# Altium project simulation.PrjPCB
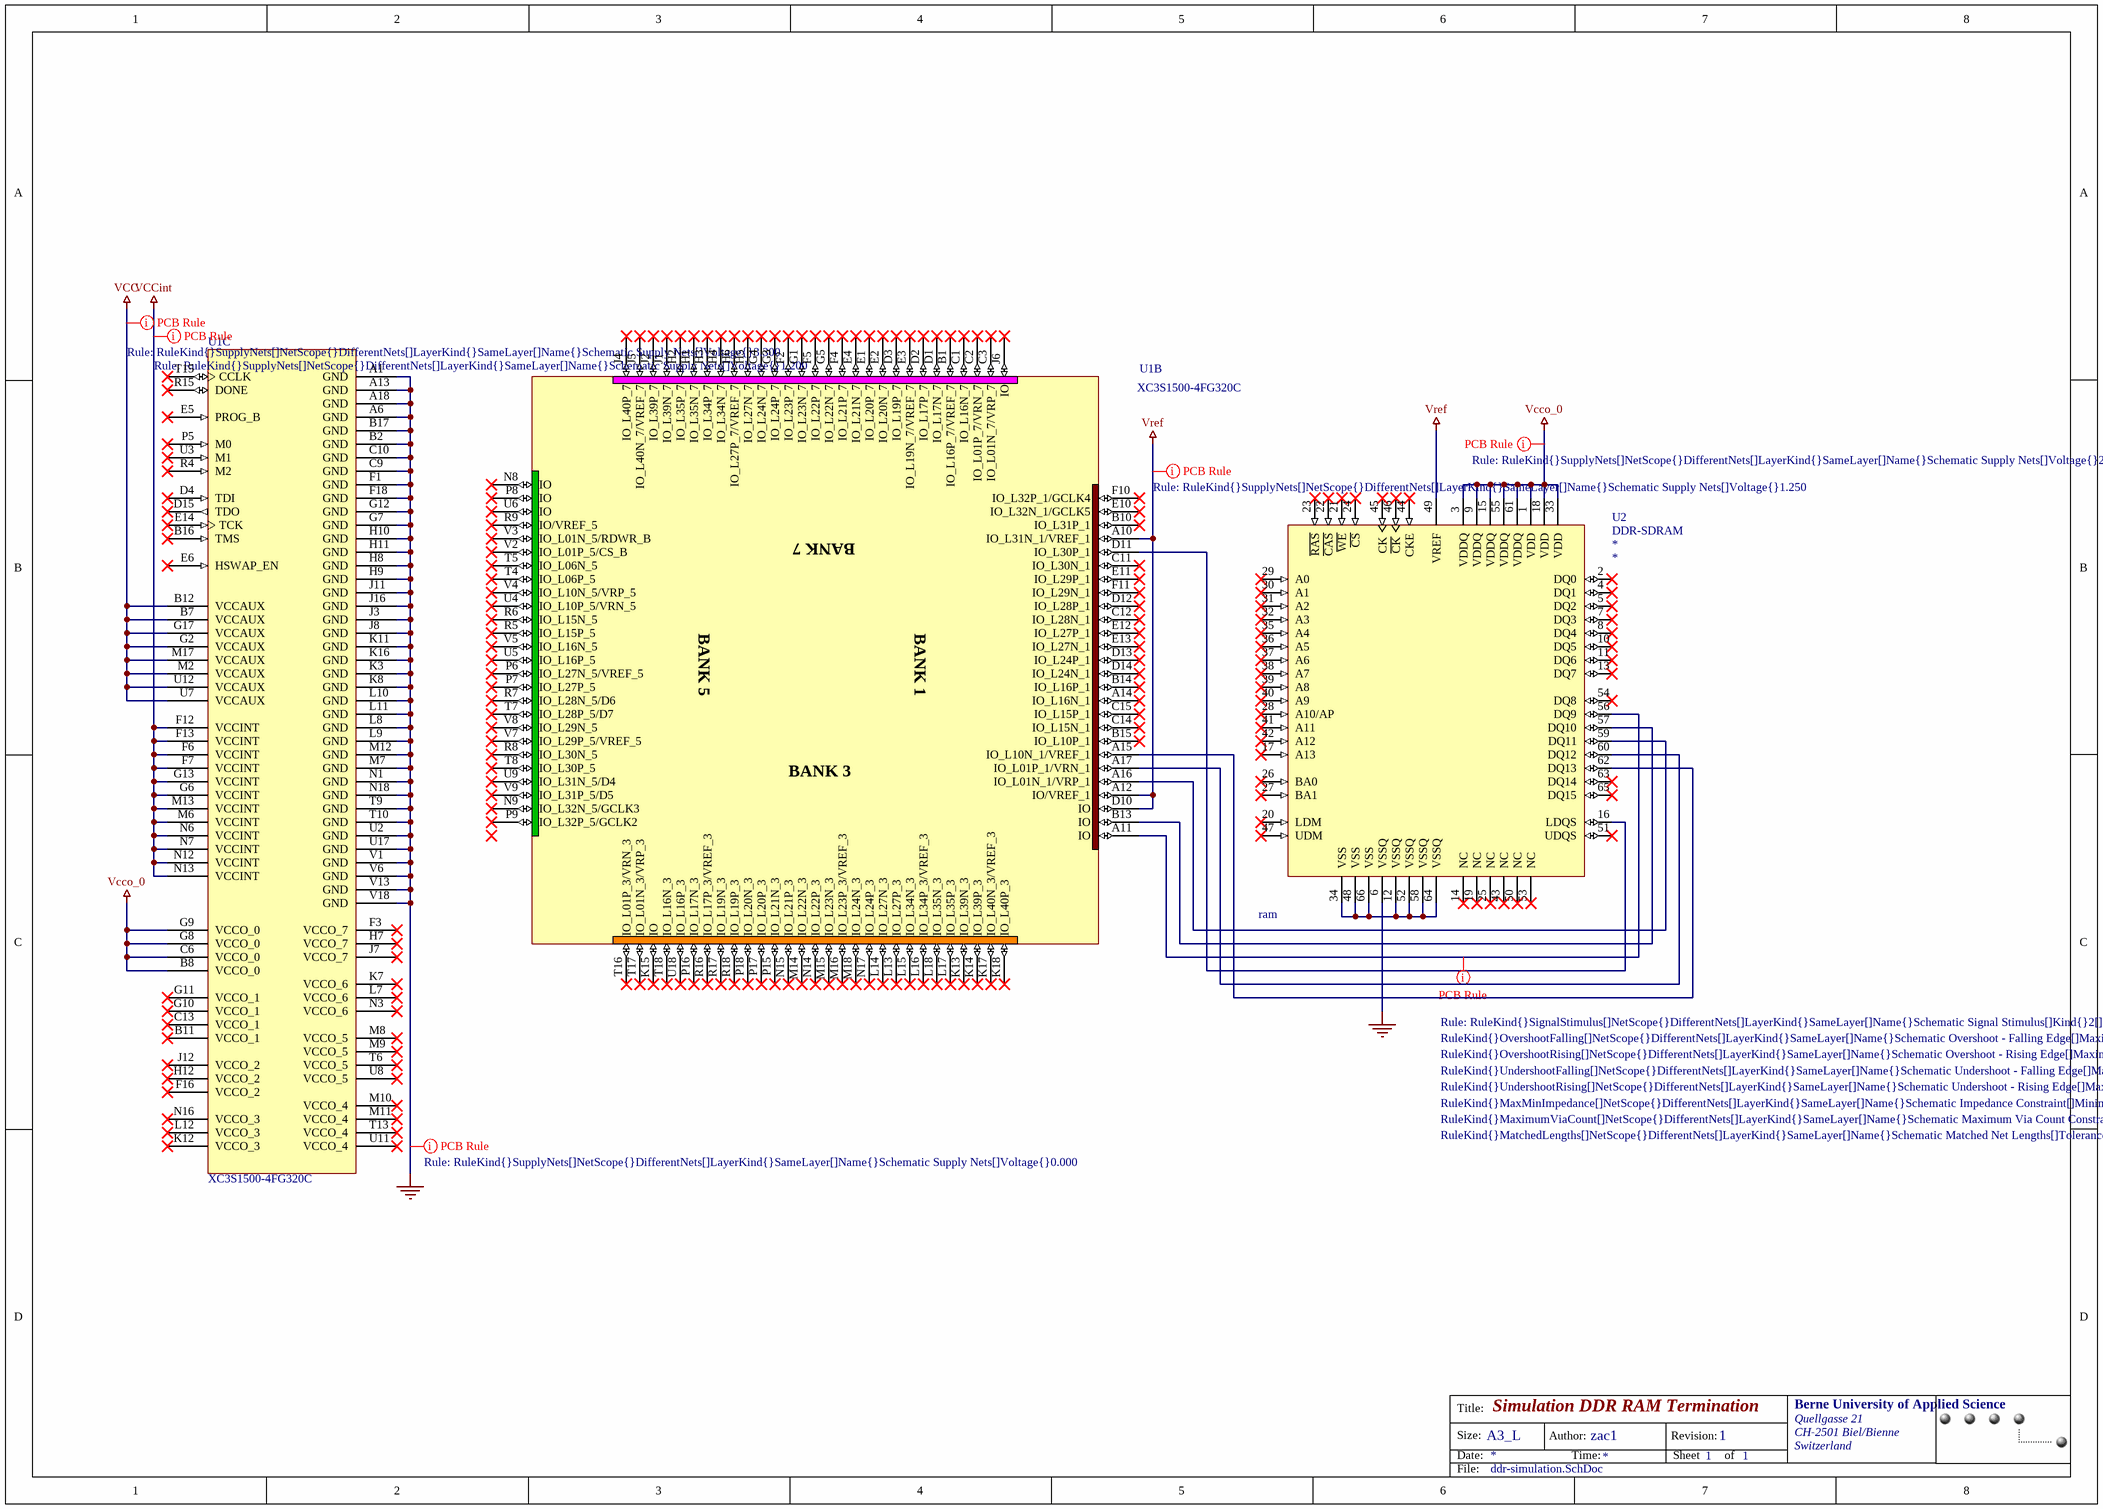
[diagram p0: ddr-simulation.SchDoc]
2 sheets, 76 parts. Net scope: global (net labels, ports and power ports of the same name join across sheets).
Sheets:
  ddr-simulation.SchDoc
  pds.SchDoc

## Sheet ddr-simulation.SchDoc: Simulation DDR RAM Termination
size A3; Organization: Berne University of Applied Science; Address1: Quellgasse 21; Address2: CH-2501 Biel/Bienne; Address3: Switzerland; Revision: 1; SheetNumber: 1; SheetTotal: 1; Author: zac1; DrawnBy: zac1

### Parts
(Parts that share a designator on the sheet are numbered #1, #2 ... from top to bottom, then left to right.)
?#1  CC License  [CC-License]  (value not drawn)
U1  XC3S1500-4FG320C  [FG320]  (parts B,C of 3)
U2  DDR-SDRAM  value ram  [TSOP66]

### Nets
GND: U1.A1(GND) U1.A6(GND) U1.A13(GND) U1.A18(GND) U1.B2(GND) U1.B17(GND) U1.C9(GND) U1.C10(GND) U1.F1(GND) U1.F18(GND) U1.G7(GND) U1.G12(GND) U1.H8(GND) U1.H9(GND) U1.H10(GND) U1.H11(GND) U1.J3(GND) U1.J8(GND) U1.J11(GND) U1.J16(GND) U1.K3(GND) U1.K8(GND) U1.K11(GND) U1.K16(GND) U1.L8(GND) U1.L9(GND) U1.L10(GND) U1.L11(GND) U1.M7(GND) U1.M12(GND) U1.N1(GND) U1.N18(GND) U1.T9(GND) U1.T10(GND) U1.U2(GND) U1.U17(GND) U1.V1(GND) U1.V6(GND) U1.V13(GND) U1.V18(GND) U2.6(VSSQ)
VCC: U1.B7(VCCAUX) U1.B12(VCCAUX) U1.G2(VCCAUX) U1.G17(VCCAUX) U1.M2(VCCAUX) U1.M17(VCCAUX) U1.U7(VCCAUX) U1.U12(VCCAUX)
VCCint: U1.F6(VCCINT) U1.F7(VCCINT) U1.F12(VCCINT) U1.F13(VCCINT) U1.G6(VCCINT) U1.G13(VCCINT) U1.M6(VCCINT) U1.M13(VCCINT) U1.N6(VCCINT) U1.N7(VCCINT) U1.N12(VCCINT) U1.N13(VCCINT)
Vcco_0: U1.B8(VCCO_0) U1.C6(VCCO_0) U1.G8(VCCO_0) U1.G9(VCCO_0) U2.1(VDD) U2.3(VDDQ) U2.9(VDDQ) U2.15(VDDQ) U2.18(VDD) U2.33(VDD) U2.55(VDDQ) U2.61(VDDQ)
Vref: U1.A10(IO_L31N_1/VREF_1) U1.A12(IO/VREF_1) U1.D10(IO) U2.49(VREF)
NetU1_A11: U1.A11(IO) U2.56(DQ9)
NetU1_A15: U1.A15(IO_L10N_1/VREF_1) U2.62(DQ13)
NetU1_A16: U1.A16(IO_L01N_1/VRP_1) U2.59(DQ11)
NetU1_A17: U1.A17(IO_L01P_1/VRN_1) U2.60(DQ12)
NetU1_B13: U1.B13(IO) U2.57(DQ10)
NetU1_D11: U1.D11(IO_L30P_1) U2.16(LDQS)
NetU2_12: U2.12(VSSQ) U2.34(VSS) U2.48(VSS) U2.52(VSSQ) U2.58(VSSQ) U2.64(VSSQ) U2.66(VSS)

Not connected (* = marked no-connect by the designer): U1 A14(IO_L16N_1)* B1(IO_L16P_7/VREF_7)* B10(IO_L31P_1)* B11(VCCO_1)* B14(IO_L16P_1)* B15(IO_L10P_1)* B16(TMS)* C1(IO_L16N_7)* C2(IO_L01P_7/VRN_7)* C3(IO_L01N_7/VRP_7)* C11(IO_L30N_1)* C12(IO_L28N_1)* C13(VCCO_1)* C14(IO_L15N_1)* C15(IO_L15P_1)* D1(IO_L17N_7)* D2(IO_L17P_7)* D3(IO_L19P_7)* D4(TDI)* D12(IO_L28P_1)* D13(IO_L24P_1)* D14(IO_L24N_1)* D15(TDO)* E1(IO_L20P_7)* E2(IO_L20N_7)* E3(IO_L19N_7/VREF_7)* E4(IO_L21N_7)* E5(PROG_B)* E6(HSWAP_EN)* E10(IO_L32N_1/GCLK5)* E11(IO_L29P_1)* E12(IO_L27P_1)* E13(IO_L27N_1)* E14(TCK)* F2(IO_L23P_7)* F3(VCCO_7)* F4(IO_L21P_7)* F5(IO_L22P_7)* F10(IO_L32P_1/GCLK4)* F11(IO_L29N_1)* F16(VCCO_2)* G1(IO_L23N_7)* G3(IO_L24P_7)* G4(IO_L24N_7)* G5(IO_L22N_7)* G10(VCCO_1)* G11(VCCO_1)* H1(IO_L35N_7)* H2(IO_L35P_7)* H3(IO_L34P_7)* H4(IO_L34N_7)* H5(IO_L27N_7)* H6(IO_L27P_7/VREF_7)* H7(VCCO_7)* H12(VCCO_2)* J1(IO_L39N_7)* J2(IO_L39P_7)* J4(IO_L40P_7)* J5(IO_L40N_7/VREF_7)* J6(IO)* J7(VCCO_7)* J12(VCCO_2)* K7(VCCO_6)* K12(VCCO_3)* K13(IO_L39N_3)* K14(IO_L39P_3)* K15(IO)* K17(IO_L40N_3/VREF_3)* K18(IO_L40P_3)* L7(VCCO_6)* L12(VCCO_3)* L13(IO_L27P_3)* L14(IO_L27N_3)* L15(IO_L34N_3)* L16(IO_L34P_3/VREF_3)* L17(IO_L35P_3)* L18(IO_L35N_3)* M8(VCCO_5)* M9(VCCO_5)* M10(VCCO_4)* M11(VCCO_4)* M14(IO_L22N_3)* M15(IO_L23N_3)* M16(IO_L23P_3/VREF_3)* M18(IO_L24N_3)* N3(VCCO_6)* N8(IO)* N9(IO_L32N_5/GCLK3)* N14(IO_L22P_3)* N15(IO_L21P_3)* N16(VCCO_3)* N17(IO_L24P_3)* P5(M0)* P6(IO_L27N_5/VREF_5)* P7(IO_L27P_5)* P8(IO)* P9(IO_L32P_5/GCLK2)* P15(IO_L21N_3)* P16(IO_L17N_3)* P17(IO_L20P_3)* P18(IO_L20N_3)* R4(M2)* R5(IO_L15P_5)* R6(IO_L15N_5)* R7(IO_L28N_5/D6)* R8(IO_L30N_5)* R9(IO/VREF_5)* R15(DONE)* R16(IO_L17P_3/VREF_3)* R17(IO_L19N_3)* R18(IO_L19P_3)* T4(IO_L06P_5)* T5(IO_L06N_5)* T6(VCCO_5)* T7(IO_L28P_5/D7)* T8(IO_L30P_5)* T13(VCCO_4)* T15(CCLK)* T16(IO_L01P_3/VRN_3)* T17(IO_L01N_3/VRP_3)* T18(IO_L16N_3)* U3(M1)* U4(IO_L10P_5/VRN_5)* U5(IO_L16P_5)* U6(IO)* U8(VCCO_5)* U9(IO_L31N_5/D4)* U11(VCCO_4)* U18(IO_L16P_3)* V2(IO_L01P_5/CS_B)* V3(IO_L01N_5/RDWR_B)* V4(IO_L10N_5/VRP_5)* V5(IO_L16N_5)* V7(IO_L29P_5/VREF_5)* V8(IO_L29N_5)* V9(IO_L31P_5/D5)*; U2 2(DQ0)* 4(DQ1)* 5(DQ2)* 7(DQ3)* 8(DQ4)* 10(DQ5)* 11(DQ6)* 13(DQ7)* 14(NC)* 17(A13)* 19(NC)* 20(LDM)* 21(~{WE})* 22(~{CAS})* 23(~{RAS})* 24(~{CS})* 25(NC)* 26(BA0)* 27(BA1)* 28(A10/AP)* 29(A0)* 30(A1)* 31(A2)* 32(A3)* 35(A4)* 36(A5)* 37(A6)* 38(A7)* 39(A8)* 40(A9)* 41(A11)* 42(A12)* 43(NC)* 44(CKE)* 45(CK)* 46(~{CK})* 47(UDM)* 50(NC)* 51(UDQS)* 53(NC)* 54(DQ8)* 63(DQ14)* 65(DQ15)*

### Layout directives
rule Supply Nets [Voltage =  3.300]: VCC
rule Supply Nets [Voltage =  1.200]: VCCint
rule Supply Nets [Voltage =  2.500]: Vcco_0
rule Supply Nets [Voltage =  1.250]: Vref
rule Supply Nets [Voltage =  0.000]: GND
rule Signal Stimulus [Kind - Periodic Pulse    Level - Low    Start Time =  0.000    Stop Time =  1.800n    Period Time =  3.600n]; rule Overshoot - Falling Edge [Max =  300.0m]; rule Overshoot - Rising Edge [Max =  300.0m]; rule Undershoot - Falling Edge [Max =  300.0m]; rule Undershoot - Rising Edge [Max =  300.0m]; rule Impedance Constraint [Min =  40.00    Max =  70.00    ]; rule Maximum Via Count Constraint [Max Count = 2]; rule Matched Net Lengths [Tolerance = 3.6mm    Style - 90 Degrees    Amplitude = 5.08mm    Gap = 0.508mm    ]: NetU1_A11

### Notes on the sheet
- Title:
- Size:
- Date:
- A3_L
- Author:
- Time:
- Revision:
- Sheet
- of
- File:
- (in symbol XC3S1500-4FG320C, part B) BANK 7; BANK 5; BANK 1; BANK 3

### Library data of the parts
U1 = XC3S1500-4FG320C: Spartan-3 1.2V FPGA, 221 User I/Os, 320-ball FBGA, Standard Performance, Commercial Grade; PackageDocument: ver1.2.1, Mar-2005; Published: 17-Dec-2003; LatestRevisionDate: 6-Jun-2005; LatestRevisionNote: Bubble removed from PROG_B pin.; DatasheetDocument: 04-Mar-2004; PackageReference: FG320; Publisher: Altium Limited; Code_JEDEC: MS-034-AAG-1; ComponentLink1Description: Manufacturer Link; ComponentLink1URL: http://www.xilinx.com/xlnx/xil_prodcat_landingpage.jsp?title=Spartan-3; ComponentLink2Description: Datasheet; ComponentLink2URL: http://direct.xilinx.com/bvdocs/publications/ds099.pdf; Value: XC3S1500-4FG320C
U2 = DDR-SDRAM: general model for ddr sdram's; vendor: *; type: *

## Sheet pds.SchDoc: GECKO3main PDS simulation
size A4; Organization: Berne University of Applied Science; Address1: Quellgasse 21; Address2: CH-2501 Biel/Bienne; Address3: Switzerland; Revision: 1; SheetNumber: 2; SheetTotal: 2; Author: zac1; DrawnBy: zac1
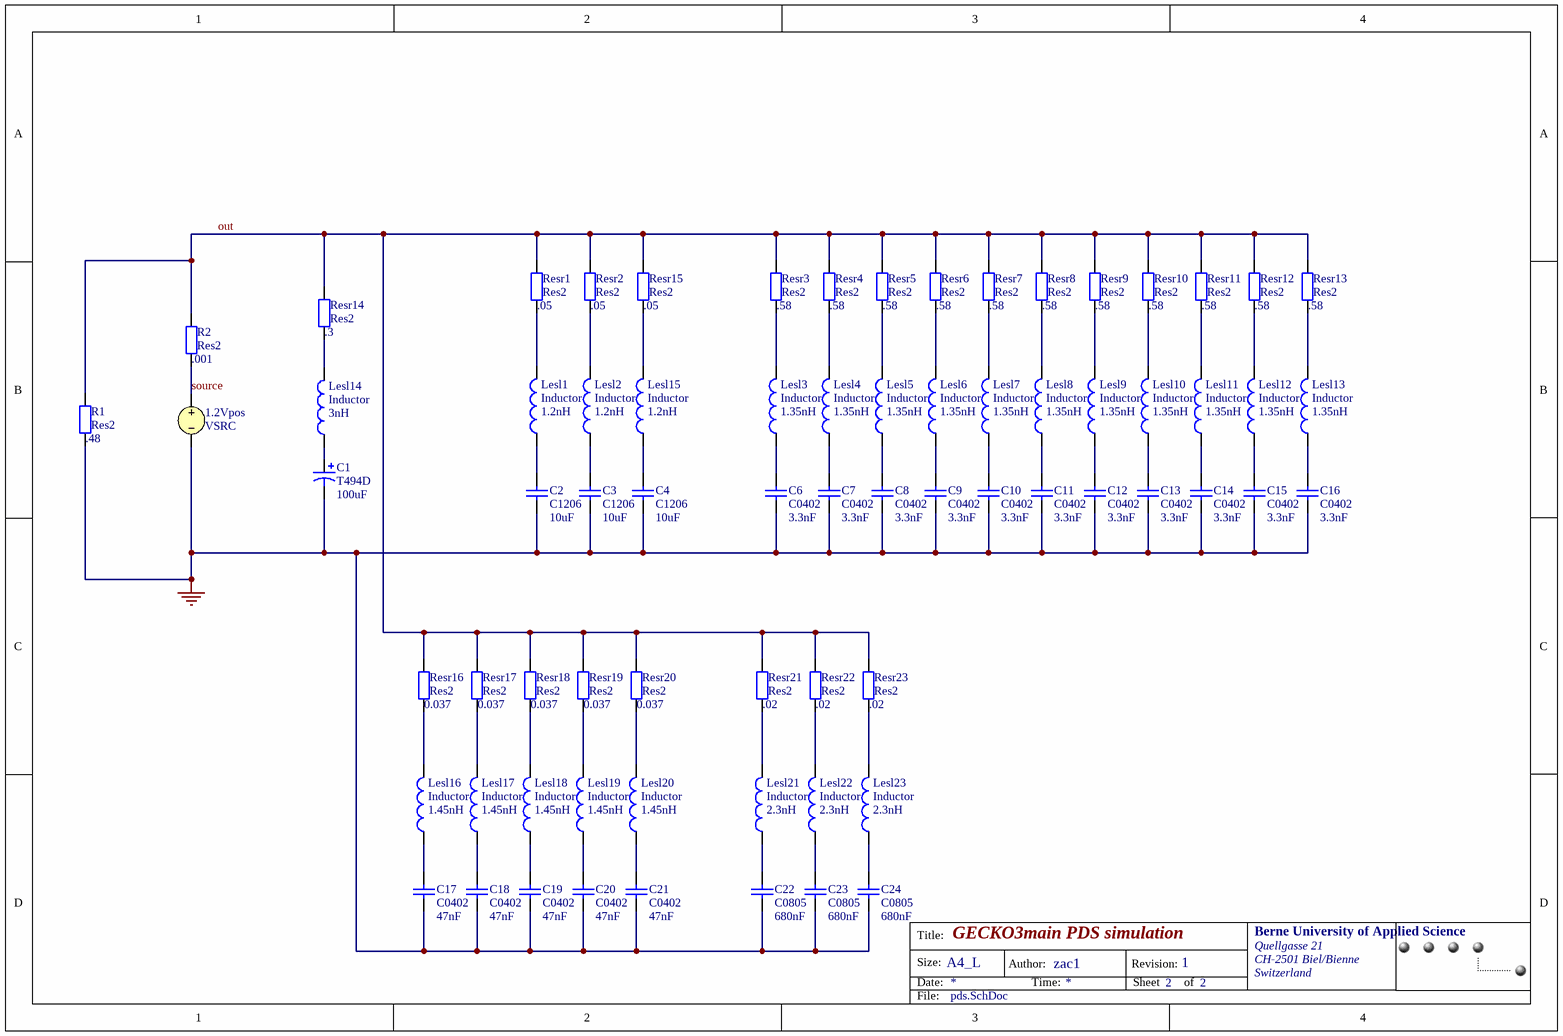
[diagram p1: pds.SchDoc]

### Parts
(Parts that share a designator on the sheet are numbered #1, #2 ... from top to bottom, then left to right.)
1.2Vpos  VSRC
?#2  CC License  [CC-License]  (value not drawn)
C1  T494D  value 100uF  [D]
C2  C1206  value 10uF  [1206]
C3  C1206  value 10uF  [1206]
C4  C1206  value 10uF  [1206]
C6  C0402  value 3.3nF  [0402]
C7  C0402  value 3.3nF  [0402]
C8  C0402  value 3.3nF  [0402]
C9  C0402  value 3.3nF  [0402]
C10  C0402  value 3.3nF  [0402]
C11  C0402  value 3.3nF  [0402]
C12  C0402  value 3.3nF  [0402]
C13  C0402  value 3.3nF  [0402]
C14  C0402  value 3.3nF  [0402]
C15  C0402  value 3.3nF  [0402]
C16  C0402  value 3.3nF  [0402]
C17  C0402  value 47nF  [0402]
C18  C0402  value 47nF  [0402]
C19  C0402  value 47nF  [0402]
C20  C0402  value 47nF  [0402]
C21  C0402  value 47nF  [0402]
C22  C0805  value 680nF  [0805]
C23  C0805  value 680nF  [0805]
C24  C0805  value 680nF  [0805]
Lesl1  Inductor  value 1.2nH  [INDC1005-0402]
Lesl2  Inductor  value 1.2nH  [INDC1005-0402]
Lesl3  Inductor  value 1.35nH  [INDC1005-0402]
Lesl4  Inductor  value 1.35nH  [INDC1005-0402]
Lesl5  Inductor  value 1.35nH  [INDC1005-0402]
Lesl6  Inductor  value 1.35nH  [INDC1005-0402]
Lesl7  Inductor  value 1.35nH  [INDC1005-0402]
Lesl8  Inductor  value 1.35nH  [INDC1005-0402]
Lesl9  Inductor  value 1.35nH  [INDC1005-0402]
Lesl10  Inductor  value 1.35nH  [INDC1005-0402]
Lesl11  Inductor  value 1.35nH  [INDC1005-0402]
Lesl12  Inductor  value 1.35nH  [INDC1005-0402]
Lesl13  Inductor  value 1.35nH  [INDC1005-0402]
Lesl14  Inductor  value 3nH  [INDC1005-0402]
Lesl15  Inductor  value 1.2nH  [INDC1005-0402]
Lesl16  Inductor  value 1.45nH  [INDC1005-0402]
Lesl17  Inductor  value 1.45nH  [INDC1005-0402]
Lesl18  Inductor  value 1.45nH  [INDC1005-0402]
Lesl19  Inductor  value 1.45nH  [INDC1005-0402]
Lesl20  Inductor  value 1.45nH  [INDC1005-0402]
Lesl21  Inductor  value 2.3nH  [INDC1005-0402]
Lesl22  Inductor  value 2.3nH  [INDC1005-0402]
Lesl23  Inductor  value 2.3nH  [INDC1005-0402]
R1  Res2  value .48  [AXIAL-0.4]
R2  Res2  value .001  [AXIAL-0.4]
Resr1  Res2  value .05  [AXIAL-0.4]
Resr2  Res2  value .05  [AXIAL-0.4]
Resr3  Res2  value .58  [AXIAL-0.4]
Resr4  Res2  value .58  [AXIAL-0.4]
Resr5  Res2  value .58  [AXIAL-0.4]
Resr6  Res2  value .58  [AXIAL-0.4]
Resr7  Res2  value .58  [AXIAL-0.4]
Resr8  Res2  value .58  [AXIAL-0.4]
Resr9  Res2  value .58  [AXIAL-0.4]
Resr10  Res2  value .58  [AXIAL-0.4]
Resr11  Res2  value .58  [AXIAL-0.4]
Resr12  Res2  value .58  [AXIAL-0.4]
Resr13  Res2  value .58  [AXIAL-0.4]
Resr14  Res2  value .3  [AXIAL-0.4]
Resr15  Res2  value .05  [AXIAL-0.4]
Resr16  Res2  value 0.037  [AXIAL-0.4]
Resr17  Res2  value 0.037  [AXIAL-0.4]
Resr18  Res2  value 0.037  [AXIAL-0.4]
Resr19  Res2  value 0.037  [AXIAL-0.4]
Resr20  Res2  value 0.037  [AXIAL-0.4]
Resr21  Res2  value .02  [AXIAL-0.4]
Resr22  Res2  value .02  [AXIAL-0.4]
Resr23  Res2  value .02  [AXIAL-0.4]

### Nets
GND: 1.2Vpos.2 C1.2 C2.1 C3.1 C4.1 C6.1 C7.1 C8.1 C9.1 C10.1 C11.1 C12.1 C13.1 C14.1 C15.1 C16.1 C17.1 C18.1 C19.1 C20.1 C21.1 C22.1 C23.1 C24.1 R1.1
out: R1.2 R2.2 Resr1.2 Resr2.2 Resr3.2 Resr4.2 Resr5.2 Resr6.2 Resr7.2 Resr8.2 Resr9.2 Resr10.2 Resr11.2 Resr12.2 Resr13.2 Resr14.2 Resr15.2 Resr16.2 Resr17.2 Resr18.2 Resr19.2 Resr20.2 Resr21.2 Resr22.2 Resr23.2
source: 1.2Vpos.1 R2.1
NetC1_1: C1.1 Lesl14.1
NetC2_2: C2.2 Lesl1.1
NetC3_2: C3.2 Lesl2.1
NetC4_2: C4.2 Lesl15.1
NetC6_2: C6.2 Lesl3.1
NetC7_2: C7.2 Lesl4.1
NetC8_2: C8.2 Lesl5.1
NetC9_2: C9.2 Lesl6.1
NetC10_2: C10.2 Lesl7.1
NetC11_2: C11.2 Lesl8.1
NetC12_2: C12.2 Lesl9.1
NetC13_2: C13.2 Lesl10.1
NetC14_2: C14.2 Lesl11.1
NetC15_2: C15.2 Lesl12.1
NetC16_2: C16.2 Lesl13.1
NetC17_2: C17.2 Lesl16.1
NetC18_2: C18.2 Lesl17.1
NetC19_2: C19.2 Lesl18.1
NetC20_2: C20.2 Lesl19.1
NetC21_2: C21.2 Lesl20.1
NetC22_2: C22.2 Lesl21.1
NetC23_2: C23.2 Lesl22.1
NetC24_2: C24.2 Lesl23.1
NetLesl1_2: Lesl1.2 Resr1.1
NetLesl2_2: Lesl2.2 Resr2.1
NetLesl3_2: Lesl3.2 Resr3.1
NetLesl4_2: Lesl4.2 Resr4.1
NetLesl5_2: Lesl5.2 Resr5.1
NetLesl6_2: Lesl6.2 Resr6.1
NetLesl7_2: Lesl7.2 Resr7.1
NetLesl8_2: Lesl8.2 Resr8.1
NetLesl9_2: Lesl9.2 Resr9.1
NetLesl10_2: Lesl10.2 Resr10.1
NetLesl11_2: Lesl11.2 Resr11.1
NetLesl12_2: Lesl12.2 Resr12.1
NetLesl13_2: Lesl13.2 Resr13.1
NetLesl14_2: Lesl14.2 Resr14.1
NetLesl15_2: Lesl15.2 Resr15.1
NetLesl16_2: Lesl16.2 Resr16.1
NetLesl17_2: Lesl17.2 Resr17.1
NetLesl18_2: Lesl18.2 Resr18.1
NetLesl19_2: Lesl19.2 Resr19.1
NetLesl20_2: Lesl20.2 Resr20.1
NetLesl21_2: Lesl21.2 Resr21.1
NetLesl22_2: Lesl22.2 Resr22.1
NetLesl23_2: Lesl23.2 Resr23.1

### Notes on the sheet
- Title:
- Size:
- Date:
- A4_L
- Author:
- Time:
- Revision:
- Sheet
- of
- File:

### Library data of the parts
1.2Vpos = VSRC: Voltage Source; Note: PCB Footprint - Not required; Value: +1.2; Published: 8-Jun-2000; LatestRevisionDate: 17-Jul-2002; LatestRevisionNote: Re-released for DXP Platform.; PackageReference: Not Applicable; Publisher: Altium Limited
C1 = T494D: Solid Tantalum Chip Capacitor, Standard T494 Series - Low ESR, Industrial Grade; Published: 17-Jul-2002; LatestRevisionDate: 19-Mar-2004; LatestRevisionNote: Silkscreen dimensions re-sized.; DatasheetDocument: Mar-2001; PackageDocument: Mar-2001; PackageReference: D; Publisher: Altium Limited; Code_JEITA: 7343-31; ComponentLink1Description: Manufacturer Link; ComponentLink1URL: http://www.kemet.com/; ComponentLink2Description: Datasheet; ComponentLink2URL: http://www.kemet.com/kemet/web/homepage/kechome.nsf/vapubfilesname/F3102TA.pdf/$file/F3102TA.pdf
C2-C4 = C1206: Ceramic Chip Capacitor - Standard; Published: 17-Jul-2002; LatestRevisionDate: 19-Mar-2004; LatestRevisionNote: Silkscreen size reduced.; DatasheetDocument: Mar-2001; PackageDocument: Mar-2001; PackageReference: 1206; Publisher: Altium Limited; Code_JEITA: 1206; Code_IPC: 3216 [1206]; ComponentLink1Description: Manufacturer Link; ComponentLink1URL: http://www.kemet.com/; ComponentLink2Description: Datasheet; ComponentLink2URL: http://www.kemet.com/kemet/web/homepage/kechome.nsf/vapubfilesname/F3102TA.pdf/$file/F3102TA.pdf
C6-C21 = C0402: Ceramic Chip Capacitor - Standard; Note: Footprint corresponds to dimensions for bulk cassette packaging. This case size has tightened tolerances.; Published: 17-Jul-2002; LatestRevisionDate: 19-Mar-2004; LatestRevisionNote: Silkscreen size reduced.; DatasheetDocument: Mar-2001; PackageDocument: Mar-2001; PackageReference: 0402; Publisher: Altium Limited; Code_JEITA: 0402; Code_IPC: 1005 [0402]; ComponentLink1Description: Manufacturer Link; ComponentLink1URL: http://www.kemet.com/; ComponentLink2Description: Datasheet; ComponentLink2URL: http://www.kemet.com/kemet/web/homepage/kechome.nsf/vapubfilesname/F3102TA.pdf/$file/F3102TA.pdf
C22-C24 = C0805: Ceramic Chip Capacitor - Standard; Note: Footprint corresponds to dimensions for bulk cassette packaging. This case size has tightened tolerances.; Published: 17-Jul-2002; LatestRevisionDate: 19-Mar-2004; LatestRevisionNote: Silkscreen size reduced.; DatasheetDocument: Mar-2001; PackageDocument: Mar-2001; PackageReference: 0805; Publisher: Altium Limited; Code_JEITA: 0805; Code_IPC: 2012[0805]; ComponentLink1Description: Manufacturer Link; ComponentLink1URL: http://www.kemet.com/; ComponentLink2Description: Datasheet; ComponentLink2URL: http://www.kemet.com/kemet/web/homepage/kechome.nsf/vapubfilesname/F3102TA.pdf/$file/F3102TA.pdf
Lesl1-Lesl23 = Inductor: Code_IEC: 1005; Published: 8-Jun-2000; LatestRevisionDate: 17-Jul-2002; LatestRevisionNote: Re-released for DXP Platform.; PackageReference: 0402-A; Publisher: Altium Limited; Code_JEITA: 0402
R1 R2 Resr1-Resr23 = Res2: Resistor; Published: 8-Jun-2000; LatestRevisionDate: 17-Jul-2002; LatestRevisionNote: Re-released for DXP Platform.; Publisher: Altium Limited

## Nets that join several sheets
GND: ddr-simulation (41 pins), pds (25 pins)